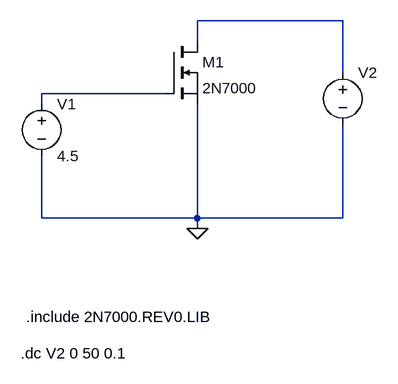
[diagram p0: schematic 2N7000.asc]
2N7000.asc, the LTspice schematic file:
Version 4.1
SHEET 1 880 680
WIRE 320 32 96 32
WIRE 96 64 96 32
WIRE 320 112 320 32
WIRE 48 144 -144 144
WIRE -144 160 -144 144
WIRE -144 336 -144 240
WIRE 96 336 96 160
WIRE 96 336 -144 336
WIRE 320 336 320 192
WIRE 320 336 96 336
WIRE 96 352 96 336
FLAG 96 352 0
SYMBOL nmos 48 64 R0
SYMATTR InstName M1
SYMATTR Value 2N7000
SYMATTR Prefix X
SYMBOL voltage -144 144 R0
WINDOW 123 0 0 Left 0
WINDOW 39 0 0 Left 0
SYMATTR InstName V1
SYMATTR Value 4.5
SYMBOL voltage 320 96 R0
SYMATTR InstName V2
SYMATTR Value ""
TEXT -168 488 Left 2 !.include 2N7000.REV0.LIB
TEXT -176 544 Left 2 !.dc V2 0 50 0.1

The netlist it stands for:
* 2N7000.asc
X§M1 N001 N002 0 2N7000  ; pins D G S
V1 N002 0 4.5
V2 N001 0
.include 2N7000.REV0.LIB
.dc V2 0 50 0.1
.backanno
.end